# EAGLE design PFC_screen (EAGLE 7.6.0)
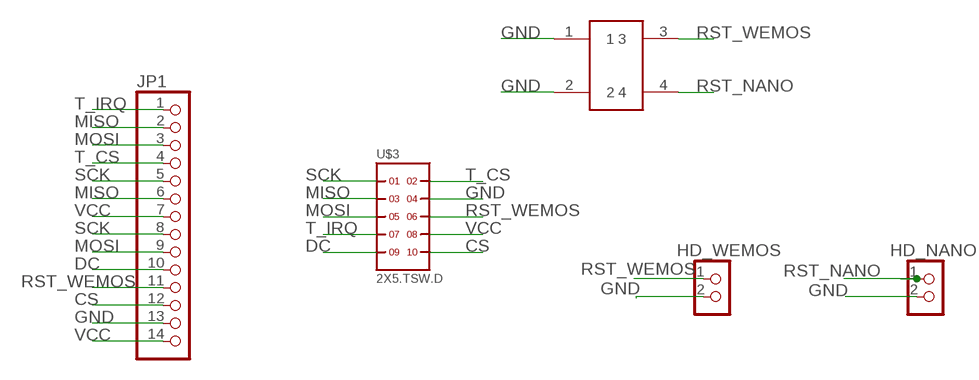
[diagram p0: schematic, sheet 1]

## Parts
HD_NANO  PINHD-2X1  [2X01]
HD_WEMOS  PINHD-2X1  [2X01]
JP1  PINHD-1X14-CB  [1X14-CB]
U$1  EK1019  [EK1019_6X6X5MM]
U$3  2X5.TSW.D  [TSW-105-XXX-D-XXX]

## Nets
CS: JP1.12 U$3.10
DC: JP1.10 U$3.9
GND: HD_NANO.2 HD_WEMOS.2 JP1.13 U$1.1 U$1.2 U$3.4
MISO: JP1.2 JP1.6 U$3.3
MOSI: JP1.3 JP1.9 U$3.5
RST_NANO: HD_NANO.1 U$1.4
RST_WEMOS: HD_WEMOS.1 JP1.11 U$1.3 U$3.6
SCK: JP1.5 JP1.8 U$3.1
T_CS: JP1.4 U$3.2
T_IRQ: JP1.1 U$3.7
VCC: JP1.7 JP1.14 U$3.8

## Library data of the parts
HD_NANO HD_WEMOS = pinhead:PINHD-2X1
JP1 = adafruit:PINHD-1X14: PIN HEADER
U$1 = adafruit:EK1019: EK1019 Push button. 6x6x5mm pushbutton
U$3 = headers(.1in)(samtec):2X5

## Board
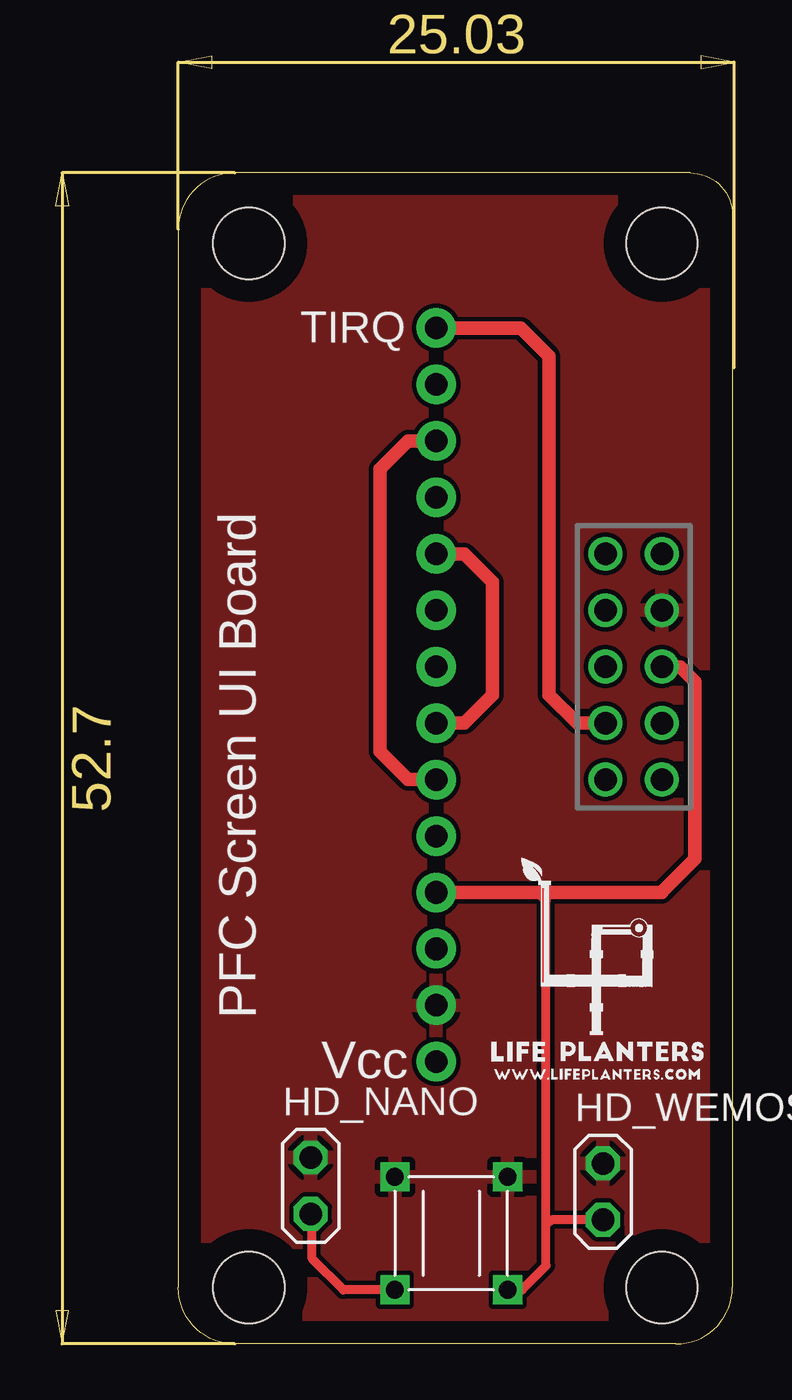
[diagram p1: board, top side]
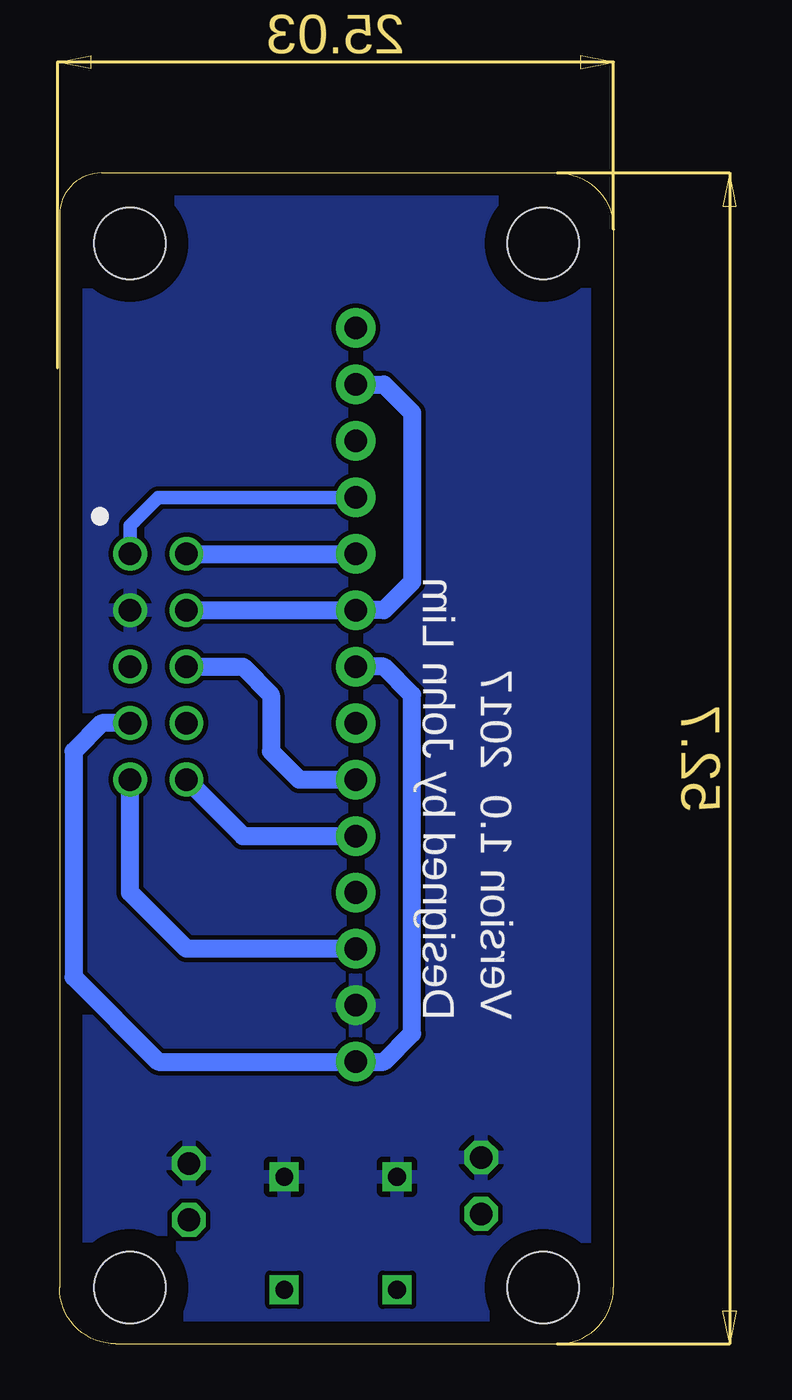
[diagram p2: board, bottom side, seen from below]

Size 24.94 x 52.7 mm. Coordinates in mm from the lower left corner, seen from the top.
Outline: 23.04,52.7 arc-90 24.94,50.8 24.94,2.54 arc-90 22.4,0 2.54,0 arc-90 0,2.54 0,50.16 arc-90 2.54,52.7 23.04,52.7
Copper layers (1*16): Top 0.035mm / dielectric 1.5mm / Bottom 0.035mm
Design rules "default": minimum track width 10mil, minimum drill 24mil, track to track 8mil, track to pad 8mil, pad to pad 8mil, via to via 8mil, smd to smd 8mil, copper to edge 40mil, drill to drill 8mil, minimum pad ring 10mil, minimum via ring 8mil, stop-mask expansion 4mil, vias tented up to drill 0mil, thermal gap 10mil
Holes 3.2 mm at 21.77,49.53 21.77,2.54 3.18,2.54 3.18,49.53

### Footprints (pad centres in the part's own frame; a part is rotated, then mirrored left to right if it is on the bottom)
2X01 = drill 1.016 octagon: 1 -1.27,-1.27; 2 -1.27,1.27
1X14-CB = drill 1.016 pad 1.778: 1 -16.51,0; 2 -13.97,0; 3 -11.43,0; 4 -8.89,0; 5 -6.35,0; 6 -3.81,0; 7 -1.27,0; 8 1.27,0; 9 3.81,0; 10 6.35,0; 11 8.89,0; 12 11.43,0; 13 13.97,0; 14 16.51,0
EK1019_6X6X5MM = drill 0.8 square: 1 -5.08,5.08; 2 -5.08,0; 3 0,5.08; 4 0,0
TSW-105-XXX-D-XXX = drill 1.016 pad 1.524: 1 -5.08,-1.27; 2 -5.08,1.27; 3 -2.54,-1.27; 4 -2.54,1.27; 5 0,-1.27; 6 0,1.27; 7 2.54,-1.27; 8 2.54,1.27; 9 5.08,-1.27; 10 5.08,1.27

### Placement (x,y rotation side)
HD_NANO  7.23,7.12 0 top
HD_WEMOS  20.39,6.86 0 top
JP1  11.61,29.21 270 top
U$1  9.75,2.44 270 top
U$3  20.5,30.48 270 top

### Tracks (layer width: path | path; a pad name or v marks a point on that pad's centre or on a via)
CS
  Bottom 0.813: JP1.12 19.23,17.78 21.77,20.32 U$3.10
DC
  Bottom 0.813: U$3.9 16.69,22.86 JP1.10
GND
  pour Bottom: 24.31,0.63 24.31,52.07 0.64,52.07 0.64,0.63
  pour Top: 0.64,0.63 0.64,52.07 24.31,52.07 24.31,0.63
MISO
  Bottom 0.813: U$3.3 JP1.6 10.34,33.02 9.07,34.29 9.07,41.91 10.34,43.18 JP1.2
MOSI
  Top 0.61: JP1.3 10.34,40.64 9.07,39.37 9.07,26.67 10.34,25.4 JP1.9
  Bottom 0.813: U$3.5 16.69,30.48 15.42,29.21 15.42,26.67 14.15,25.4 JP1.9
RST_NANO
  Top 0.406: U$1.4 7.43,2.44 6.03,3.84 6.03,5.78 HD_NANO.1
RST_WEMOS
  Top 0.406: U$1.3 15.48,2.44 16.56,3.52 16.56,5.36 | 16.56,5.36 16.56,19.94 16.18,20.32 | HD_WEMOS.1 16.79,5.59 16.56,5.36
  Top 0.61: JP1.11 16.18,20.32 21.77,20.32 21.77,20.34 23.26,21.83 23.26,29.81 22.61,30.46 21.79,30.46 U$3.6
SCK
  Top 0.61: JP1.8 12.88,27.94 14.15,29.21 14.15,34.29 12.88,35.56 JP1.5
  Bottom 0.813: U$3.1 JP1.5
T_CS
  Bottom 0.61: U$3.2 21.77,36.83 20.5,38.1 JP1.4
T_IRQ
  Top 0.61: U$3.7 17.96,27.94 16.69,29.21 16.69,44.45 15.42,45.72 JP1.1
VCC
  Bottom 0.813: JP1.7 10.34,30.48 9.07,29.21 9.07,13.97 10.34,12.7 JP1.14 20.5,12.7 24.31,16.51 24.31,26.67 23.04,27.94 U$3.8

### Text on the board
tPlace: TIRQ | PFC Screen UI Board | Vcc
bPlace: Version 1.0 2017 | Designed by John Lim